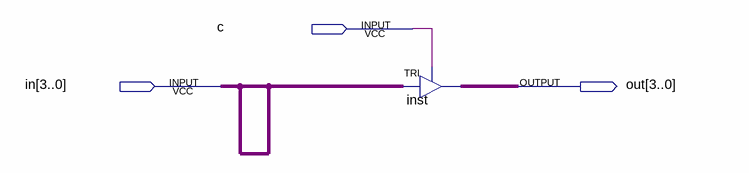
[diagram p0: schematic sheet]
// Quartus schematic nothing.bdf as structural Verilog: 1 symbols, 3 pins
module nothing (
  input  c,
  input  [3:0] in,
  output [3:0] out
);

  TRI inst[3:0] (.IN(in), .OE(c), .OUT(out));
endmodule
